# Altium project Logic_Gates_4.PrjPcb (part 2 of 2)

## Sheet Sound.SchDoc: =SheetTitle
size A4; CompanyName: Catcatcat Electronics; Engineer: Hena Chernov; Organization: Catcatcat Electronics; SheetNumber: 7; SheetTotal: 10; CodePhone: +380505759863; SheetDescription: Interactive tactile and audio feedback module.; Email: catcatcat.electronics@gmail.com
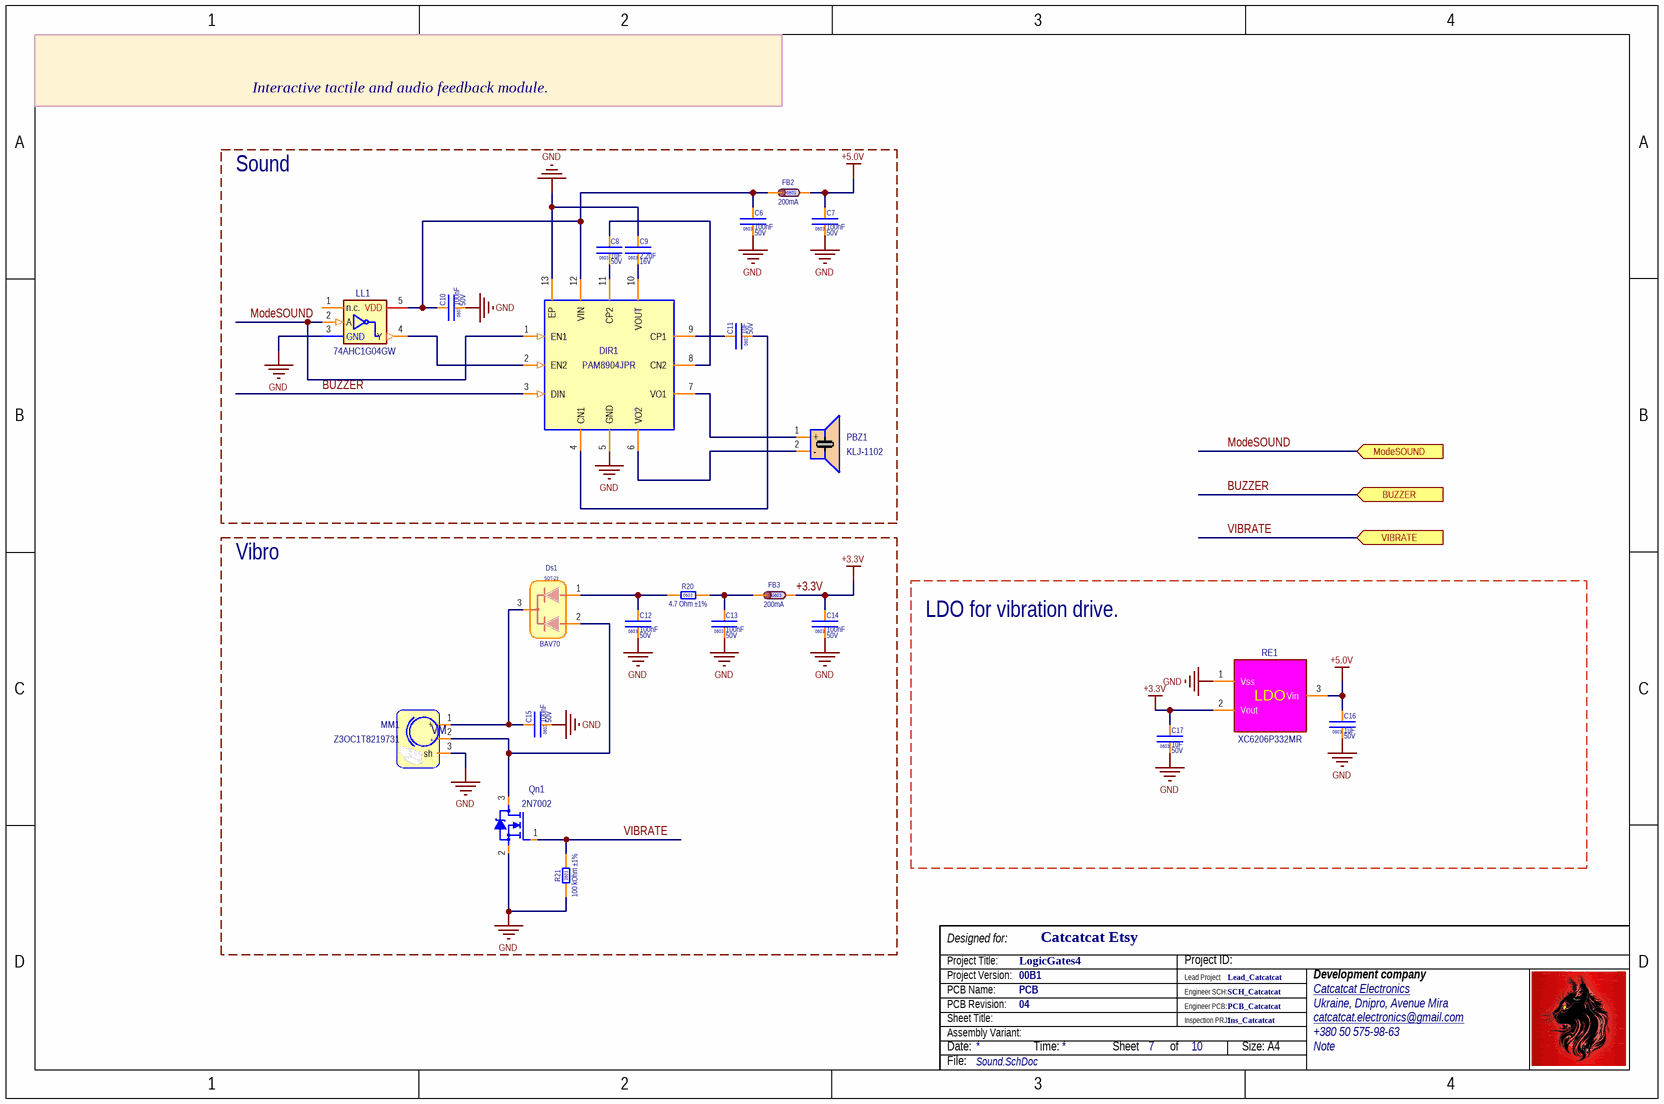
[diagram p7: Sound.SchDoc]

### Parts
C6  value 100nF  Voltage: 50V  [CC0603(1608)x0.8]  (hidden comment: 100 nF ±10% 50V)
C7  value 100nF  Voltage: 50V  [CC0603(1608)x0.8]  (hidden comment: 100 nF ±10% 50V)
C8  value 1uF  Voltage: 50V  [CC0603(1608)x0.8]  (hidden comment: 1uF ±10% 50V 0603)
C9  value 2.2uF  Voltage: 16V  [CC0603(1608)x0.8]  (hidden comment: 2.2uF ±10% 16V 0603)
C10  value 100nF  Voltage: 50V  [CC0603(1608)x0.8]  (hidden comment: 100 nF ±10% 50V)
C11  value 1uF  Voltage: 50V  [CC0603(1608)x0.8]  (hidden comment: 1uF ±10% 50V 0603)
C12  value 100nF  Voltage: 50V  [CC0603(1608)x0.8]  (hidden comment: 100 nF ±10% 50V)
C13  value 100nF  Voltage: 50V  [CC0603(1608)x0.8]  (hidden comment: 100 nF ±10% 50V)
C14  value 100nF  Voltage: 50V  [CC0603(1608)x0.8]  (hidden comment: 100 nF ±10% 50V)
C15  value 100nF  Voltage: 50V  [CC0603(1608)x0.8]  (hidden comment: 100 nF ±10% 50V)
C16  value 1uF  Voltage: 50V  [CC0603(1608)x0.8]  (hidden comment: 1uF ±10% 50V 0603)
C17  value 1uF  Voltage: 50V  [CC0603(1608)x0.8]  (hidden comment: 1uF ±10% 50V 0603)
DIR1  PAM8904JPR  [FP-U-QFN3030-12_Type_B-IPC_C]
Ds1  Case/Package: SOT-23  [SOT-23 - pdf]  (hidden comment: BAV70)
FB2  value 200mA  [FB0603(1608)]  (hidden comment: GZ1608D601TF)
FB3  value 200mA  [FB0603(1608)]  (hidden comment: GZ1608D601TF)
LL1  value 74AHC1G04GW  [SOT353-5-TSSOP-M]  (hidden comment: 74AHC1G04GW,125)
MM1  Z3OC1T8219731  [VibrationMotor]
PBZ1  KLJ-1102  [Cy-SMD-1102-5041]
Qn1  2N7002  [SOT-23 - pdf]
R20  value 4.7 Ohm ±1%  [RC0603(1608) -1%]  (hidden comment: 4.7R ±1% 0603)
R21  value 100 kOhm ±1%  [RC0603(1608) -1%]  (hidden comment: 100K ±1%)
RE1  XC6206P332MR  [FP-SOT23-IPC_C]

### Blocks framed on the sheet
Sound: C6-C11 DIR1 FB2 LL1 PBZ1
Vibro: C12-C15 Ds1 FB3 MM1 Qn1 R20 R21
LDO for vibration drive.: C16 C17 RE1

### Ports
BUZZER (in), ModeSOUND (in), VIBRATE (in)

### Nets
+3.3V: C14.2 C17.2 FB3.2 RE1.2(Vout)
+5.0V: C7.2 C16.2 FB2.2 RE1.3(Vin)
GND: C6.1 C7.1 C9.2 C10.1 C12.1 C13.1 C14.1 C15.1 C16.1 C17.1 DIR1.5(GND) DIR1.13(EP) LL1.3(GND) MM1.3(sh) Qn1.2(S) R21.1 RE1.1(Vss)
BUZZER: DIR1.3(DIN) ; port BUZZER
ModeSOUND: DIR1.1(EN1) LL1.2(A) ; port ModeSOUND
VIBRATE: Qn1.1(G) R21.2 ; port VIBRATE
NetC6_2: C6.2 C10.2 DIR1.12(VIN) FB2.1 LL1.5(VDD)
NetC8_1: C8.1 DIR1.11(CP2)
NetC8_2: C8.2 DIR1.8(CN2)
NetC9_1: C9.1 DIR1.10(VOUT)
NetC11_1: C11.1 DIR1.4(CN1)
NetC11_2: C11.2 DIR1.9(CP1)
NetC12_2: C12.2 Ds1.1 R20.1
NetC13_2: C13.2 FB3.1 R20.2
NetC15_2: C15.2 Ds1.3 MM1.1(+)
NetDIR1_2: DIR1.2(EN2) LL1.4(Y)
NetDIR1_6: DIR1.6(VO2) PBZ1.2(-)
NetDIR1_7: DIR1.7(VO1) PBZ1.1(+)
NetDs1_2: Ds1.2 MM1.2(-) Qn1.3(D)

Not connected (* = marked no-connect by the designer): LL1 1(n.c.)

### Notes on the sheet
- Project Title:
- Project Version:
- Designed for:
- Lead Project
- Project ID:
- Development company
- Date:
- PCB Revision:
- PCB Name:
- Sheet Title:
- Assembly Variant:
- Time:
- Sheet
- of
- Engineer SCH:
- Engineer PCB:
- Inspection PRJ:
- Size: A4
- File:
- (in symbol XC6206P332MR (B)) LDO
- (in symbol Z3OC1T8219731 (E)) VM

### Library data of the parts
C6 C7 C10 C12-C15 = 0603 0.1 uF (B): 100 nF ±10% 50V X7R; Manufacturer 1: YAGEO; Manufacturer Part Number 1: CC0603KRX7R9BB104; Note: Ceramic Capacitors; Detailed Description: 50V 100nF X7R ±10% 0603  Multilayer Ceramic Capacitors MLCC - SMD/SMT ROHS; Case/Package: 0603; Publisher: Catcatcat Electronics; Tolerance: ±10%; HelpURL: https://datasheet.lcsc.com/lcsc/1809301912_YAGEO-CC0603KRX7R9BB104_C14663.pdf; website developer: http://catcatcat.d-lan.dp.ua/; Temperature Coefficient: X7R; Supplier URL 1: https://jlcpcb.com/parts/componentSearch?searchTxt=; Operating Temperature: -55C to +125C; Supplier Part Number 1: C14663; Supplier Unit Price 1: 0.0021; Assembly type: Basic Part; Footprint check status: Verified; QuantityElements: 1; Supplier 1: LCSC; MountType: SMD
C8 C11 C16 C17 = 0603 1.0 uF 50V (B): 1.0 uF ±10% 50V X5R; Manufacturer 1: Samsung Electro-Mechanics; Manufacturer Part Number 1: CL10A105KB8NNNC; Note: Ceramic Capacitors; Detailed Description: 50V 1uF X5R ±10% 0603  Multilayer Ceramic Capacitors MLCC - SMD/SMT ROHS; Case/Package: 0603; Publisher: Catcatcat Electronics; Tolerance: ±10%; HelpURL: https://datasheet.lcsc.com/szlcsc/Samsung-Electro-Mechanics-CL10A105KB8NNNC_C15849.pdf; Website Developer: http://catcatcat.d-lan.dp.ua/; Temperature Coefficient: X5R; Supplier URL 1: https://jlcpcb.com/parts/componentSearch?searchTxt=; Operating Temperature: -55C to +125C; Supplier Part Number 1: C15849; Supplier Unit Price 1: 0.0051; Assembly type: Basic Part; Footprint check status: Verified; QuantityElements: 1; Supplier 1: LCSC; MountType: SMD
C9 = 0603 2.2 uF 16V (B): 2.2 uF ±10% 16V X5R; Manufacturer 1: Samsung Electro-Mechanics; Manufacturer Part Number 1: CL10A225KO8NNNC; Note: Ceramic Capacitors; Detailed Description: 16V 2.2uF X5R ±10% 0603  Multilayer Ceramic Capacitors MLCC - SMD/SMT ROHS; Case/Package: 0603; Publisher: Catcatcat Electronics; Tolerance: ±10%; HelpURL: https://datasheet.lcsc.com/szlcsc/Samsung-Electro-Mechanics-CL10A225KO8NNNC_C23630.pdf; website developer: http://catcatcat.d-lan.dp.ua/; Temperature Coefficient: X5R; Supplier URL 1: https://jlcpcb.com/parts/componentSearch?searchTxt=; Operating Temperature: -55C to +125C; Supplier Part Number 1: C23630; Supplier Unit Price 1: 0.0059; Assembly type: Basic Part; Footprint check status: Verified; QuantityElements: 1; Supplier 1: LCSC; MountType: SMD
DIR1 = PAM8904JPR (E): PIEZO SOUNDER DRIVER 18VPP OUTPUT; Manufacturer 1: Diodes Incorporated; Note: A/D converter; Temp.Characteristic: -40°C ~ 85°C (TA); Voltage: 1.8V to 5.5V; Output Impedance: Ohms; Output Power: W; Total Harmonic Distortion: %; Supplier URL 1: https://www.lcsc.com/product-detail/Audio-Power-OpAmps_Diodes-Incorporated-PAM8904JPR_C780875.html; HelpURL: https://datasheet.lcsc.com/lcsc/2210281000_Diodes-Incorporated-PAM8904JPR_C780875.pdf; Manufacturer Part Number 1: PAM8904JPR; Case/Package: UQFN3030-12; Supplier Unit Price 1: 0.4560; Publisher: Catcatcat Electronics; Website Developer: http://catcatcat.d-lan.dp.ua/; Detailed Description: PIEZO SOUNDER DRIVER 18VPP OUTPUT; Operating Temperature: -40 to +85°C; Supplier Part Number 1: C780875; Assembly type: Extended Part; Footprint check status: Verified; QuantityElements: 1; Supplier 1: LCSC; MountType: SMD; ECCN: EAR99; Value: PAM8904JPR
Ds1 = BAV70 (B): Switching SOT-23, 200 mA 70 V; Manufacturer 1: Changjiang Electronics Tech (CJ); Temp.Characteristic: -40C to +85C; Voltage: 70 V; Note: Diode; Marking: A4; Detailed Description: 70V +150℃@(Tj) 225mW Dual Common Cathode 1.25V@150mA 6ns 2.5uA@70V 200mA SOT-23  Switching Diode ROHS; Current: 150mA; Reverse Current (uA/5V/25°C): uA; Publisher: Catcatcat Electronics; HelpURL: https://datasheet.lcsc.com/lcsc/1809211023_Jiangsu-Changjing-Electronics-Technology-Co---Ltd--BAV70_C68978.pdf; Manufacturer Part Number 1: BAV70; Website developer: http://catcatcat.d-lan.dp.ua/; Supplier URL 1: https://www.lcsc.com/product-detail/Switching-Diode_Jiangsu-Changjing-Electronics-Technology-Co-Ltd-BAV70_C68978.html; Supplier Part Number 1: C68978; Supplier Unit Price 1: 0.0195; Assembly type: Basic Part; Footprint check status: Verified; QuantityElements: 1; Supplier 1: LCSC; MountType: SMD; Value: BAV70
FB2 FB3 = 0603 GZ1608D601TF (B): 0.20A 600 Ohm @100MHz 450 mOhm; Manufacturer 1: Sunlord; Temp.Characteristic: -55°C ~ 125°C; Note: Ferrite Beads and Chips; Detailed Description: 450mΩ ±25% 600Ω@100MHz 0603  Ferrite Beads ROHS; Case/Package: 0603; Publisher: Catcatcat Electronics; HelpURL: https://datasheet.lcsc.com/lcsc/1811091241_Sunlord-GZ1608D601TF_C1002.pdf; website developer: http://catcatcat.d-lan.dp.ua/; Manufacturer Part Number 1: GZ1608D601TF; Supplier URL 1: https://jlcpcb.com/parts/componentSearch?searchTxt=; Supplier Part Number 1: C1002; Supplier Unit Price 1: 0.0045; Assembly type: Basic Part; Footprint check status: Verified; QuantityElements: 1; Supplier 1: LCSC; MountType: SMD
LL1 = 74AHC1G04GW,125 (E): IC INVERTER 1CH 1-INP 5TSSOP; Manufacturer 1: Nexperia USA Inc.; Voltage: 2 V ~ 5.5 V; Note: Inverter IC 1 Channel; Detailed Description: Inverter IC 1 Channel  5-TSSOP; Supplier URL 1: https://www.digikey.com/product-detail/en/nexperia-usa-inc/74AHC1G04GW125/1727-3147-2-ND/1022776; Publisher: Catcatcat Electronics; Operating Temperature: -40°C ~ 125°C (TA); HelpURL: https://assets.nexperia.com/documents/data-sheet/74AHC_AHCT1G04.pdf; Manufacturer Part Number 1: 74AHC1G04GW,125; Website developer: http://catcatcat.d-lan.dp.ua/; Case/Package: 5-TSSOP, SC-70-5, SOT-353; Supplier Part Number 1: C148197; Supplier Unit Price 1: 0.0493; Assembly type: Extended Part; Footprint check status: Verified; QuantityElements: 1; Supplier 1: LCSC; MountType: SMD
MM1 = Z3OC1T8219731 (E): DC Motor Vibration, ROHS; Manufacturer 1: KOTL; Note: Micro Motor & Motor ROHS; Voltage: 2-3.6V; Assembly type: Extended Part; HelpURL: https://www.endrich.com/sixcms/media.php/2/Z30C1T8219651.pdf; Manufacturer Part Number 1: Z3OC1T8219731; Case/Package: SMD; Supplier Part Number 1: C2894731; Supplier Unit Price 1: 0.6504; Publisher: Catcatcat Electronics; Website developer: http://catcatcat.d-lan.dp.ua/; Footprint check status: Verified; QuantityElements: 1; Supplier 1: LCSC; MountType: Plug-in; Value: Z3OC1T8219731
PBZ1 = KLJ-1102 (E): Piezoelectric buzzer, Externally Driven 70dB@5V,10cm Externally Driven SMD,9x11mm  Buzzers ROHS; Manufacturer 1: KELIKING; Voltage: 5V; Current: ≤120mA; Sound Pressure Level (dB/min.): ≥75dB; Assembly type: Extended Part; Supplier URL 1: https://www.lcsc.com/product-detail/Buzzers_KELIKING-KLJ-1102_C201047.html; Detailed Description: Externally Driven 70dB@5V,10cm Externally Driven SMD,9x11mm  Buzzers ROHS; HelpURL: https://datasheet.lcsc.com/lcsc/1808301123_KELIKING-KLJ-1102_C201047.pdf; Manufacturer Part Number 1: KLJ-1102; Note: Piezoelectric buzzer; Operating Temperature: -20 ~ +80; Case/Package: SMD,9x11mm; Supplier Part Number 1: C201047; Supplier Unit Price 1: 0.4680; Publisher: Catcatcat Electronics; Website developer: http://catcatcat.d-lan.dp.ua/; Footprint check status: Verified; QuantityElements: 1; Supplier 1: LCSC; MountType: SMD; Value: KLJ-1102
Qn1 = 2N7002 (B): N-Channel SOT-23 60V 115mA 200mW 7.5Ω@10V,500mA 2.5V@250uA  SOT-23(SOT-23-3)  MOSFETs ROHS; Manufacturer 1: Changjiang Electronics Tech (CJ); Note: Transistor; Temp.Characteristic: -40C to +85C; Marking: 7002; Detailed Description: 60V 115mA 200mW 7.5Ω@10V,500mA 2.5V@250uA N Channel SOT-23(SOT-23-3)  MOSFETs ROHS; Supplier Unit Price 1: 0.0139; Publisher: Catcatcat Electronics; Voltage: 60V; Supplier URL 1: https://jlcpcb.com/parts/componentSearch?searchTxt=C8545; HelpURL: https://datasheet.lcsc.com/szlcsc/Changjiang-Electronics-Tech-CJ-2N7002_C8545.pdf; Manufacturer Part Number 1: 2N7002; Website developer: http://catcatcat.d-lan.dp.ua/; Operating Temperature: -55°C ~ 150°C (TJ); Case/Package: SOT-23; Supplier Part Number 1: C8545; Assembly type: Basic Part; Footprint check status: Verified; QuantityElements: 1; Supplier 1: LCSC; MountType: SMD; Value: 2N7002
R20 = 0603 4.7 Ohm ±1% (B): 4.7 R (4R7) ±1% 1/10W 75V; Manufacturer 1: UNI-ROYAL(Uniroyal Elec); Manufacturer Part Number 1: 0603WAF470KT5E; Note: Chip Resistor - Surface Mount; Temperature Coefficient: ±400ppm/℃; Detailed Description: 100mW Thick Film Resistors ±1% ±400ppm/℃ 4.7Ω 0603  Chip Resistor - Surface Mount ROHS; Publisher: Catcatcat Electronics; Tolerance: ±1%; Voltage: 75V; HelpURL: https://datasheet.lcsc.com/lcsc/2206010116_UNI-ROYAL-Uniroyal-Elec-0603WAF470KT5E_C23164.pdf; Marking: 4R7; Power (Watts): 1/10W; Supplier URL 1: https://www.lcsc.com/product-detail/Chip-Resistor-Surface-Mount_UNI-ROYAL-Uniroyal-Elec-0603WAF470KT5E_C23164.html; Manufacturer URL: http://uniohm.com/; Operating Temperature: -55°C ~ 155°C; Supplier Part Number 1: C23164; Supplier Unit Price 1: 0.0014; Assembly type: Basic Part; Footprint check status: Verified; QuantityElements: 1; Supplier 1: LCSC; Website Developer: http://catcatcat.d-lan.dp.ua/; MountType: SMD; Case/Package: 0603
R21 = 0603 100 kOhm ±1% (B): 100 k (104) ±1% 1/10W 50V; Manufacturer 1: UNI-ROYAL(Uniroyal Elec); Manufacturer Part Number 1: 0603WAF1003T5E; Note: Chip Resistor - Surface Mount; Temperature Coefficient: ±100 ppm/℃; Detailed Description: 100mW Thick Film Resistors ±100ppm/℃ ±1% 100kΩ 0603  Chip Resistor - Surface Mount ROHS; Publisher: Catcatcat Electronics; Tolerance: ±1%; Voltage: 50V; HelpURL: https://datasheet.lcsc.com/szlcsc/Uniroyal-Elec-0603WAF1003T5E_C25803.pdf; Power (Watts): 1/10W; Supplier URL 1: https://jlcpcb.com/parts/componentSearch?searchTxt=C25803; Operating Temperature: -55°C ~ 155°C; Supplier Part Number 1: C25803; Supplier Unit Price 1: 0.0009; Assembly type: Basic Part; Footprint check status: Verified; QuantityElements: 1; Supplier 1: LCSC; Website Developer: http://catcatcat.d-lan.dp.ua/; MountType: SMD; Case/Package: 0603
RE1 = XC6206P332MR (B): LDO 5.0V 3.3V 200mA Fixed 3.3V~3.3V Positive 6V SOT-23-3L  Linear Voltage Regulators (LDO) ROHS; Manufacturer 1: Torex Semicon; Note: LOW DROPOUT REGULATORS(LDO); Marking: 662V; Voltage - Input (Min)/(Max): 5V; Supplier URL 1: https://jlcpcb.com/parts/componentSearch?searchTxt=C5446; Case/Package: SOT-23-3L; Supplier Part Number 1: C5446; Operating Temperature: -40C to +85C; Voltage: 3.3V; HelpURL: https://eu.mouser.com/datasheet/2/760/TOSL_S_A0007229533_1-2575067.pdf; Manufacturer Part Number 1: XC6206P332MR; Detailed Description: 200mA Fixed 3.3V~3.3V Positive 6V SOT-23-3L  Linear Voltage Regulators (LDO) ROHS; Supplier Unit Price 1: 0.0992; Publisher: Catcatcat Electronics; Website developer: http://catcatcat.d-lan.dp.ua/; Assembly type: Basic Part; Footprint check status: Verified; Current - Output (Max): 200mA; QuantityElements: 1; Supplier 1: LCSC; MountType: SMD; Value: XC6206P332MR

## Sheet USB Power.SchDoc: =SheetTitle
size A4; CompanyName: Catcatcat Electronics; Engineer: Hena Chernov; Organization: Catcatcat Electronics; SheetNumber: 10; SheetTotal: 10; CodePhone: +380505759863; SheetDescription: Power, USB-bridge.; Email: catcatcat.electronics@gmail.com
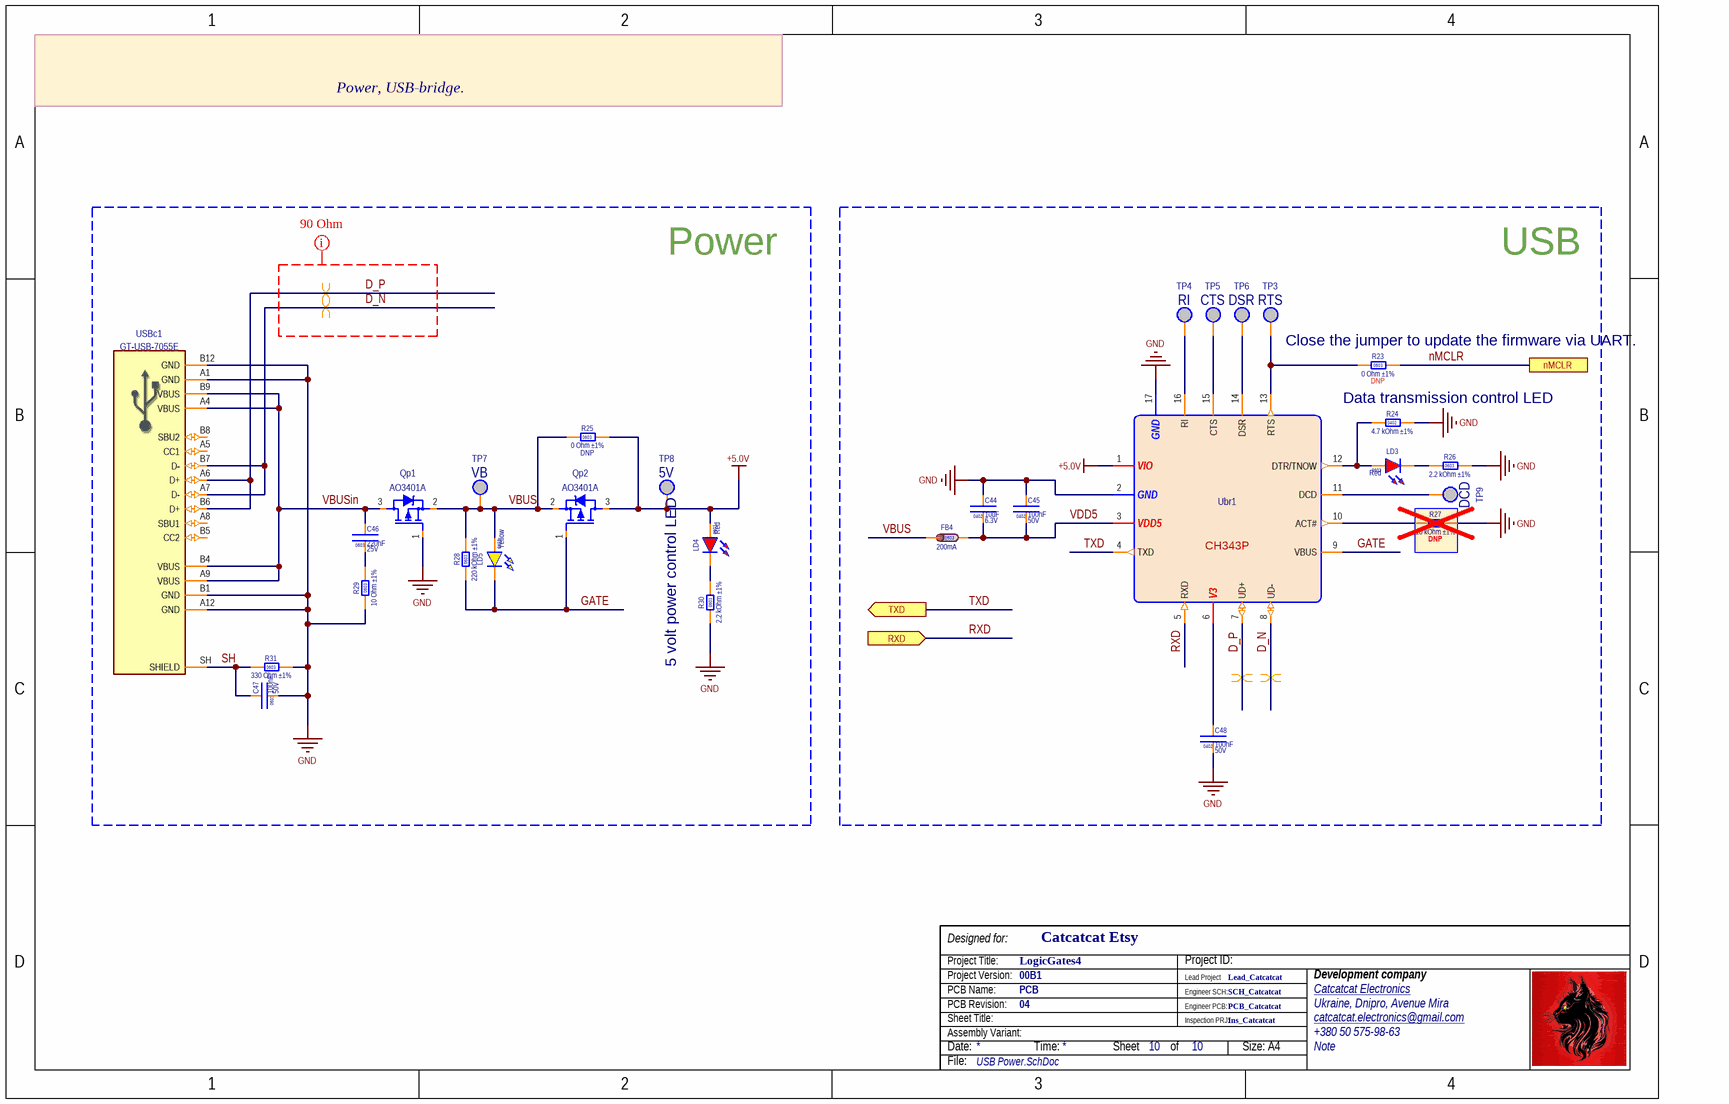
[diagram p8: USB Power.SchDoc]

### Parts
C44  value 10uF  Voltage: 6.3V  [CC0402(1005)x0.5]  (hidden comment: 10 uF 6.3V ±10%)
C45  value 100nF  Voltage: 50V  [CC0402(1005)x0.5]  (hidden comment: 100nF 50V ±10% 0402)
C46  value 220nF  Voltage: 25V  [CC0603(1608)x0.8]  (hidden comment: 0.22 uF ±10%)
C47  value 100nF  Voltage: 50V  [CC0603(1608)x0.8]  (hidden comment: 100 nF ±10% 50V)
C48  value 100nF  Voltage: 50V  [CC0402(1005)x0.5]  (hidden comment: 100nF 50V ±10% 0402)
FB4  value 200mA  [FB0603(1608)]  (hidden comment: GZ1608D601TF)
LD3  value Red  Case/Package: 0603  [LD0603 RED]  (hidden comment: KT-0603R)
LD4  value Red  Case/Package: 0603  [LD0603 RED]  (hidden comment: KT-0603R)
LD5  value Yellow  Case/Package: 0603  [LD0603 YELLOW]  (hidden comment: LED 0603 Yellow 120° 60mW)
Qp1  AO3401A  [FP-SOT23-IPC_C]
Qp2  AO3401A  [FP-SOT23-IPC_C]
R23  value 0 Ohm ±1%  Assembly type: DNP  [RC0603(1608)A J]  (hidden comment: 0R ±1% 0603)
R24  value 4.7 kOhm ±1%  [RC0402(1005)-1%]  (hidden comment: 4.7K ±1% 0402)
R25  value 0 Ohm ±1%  Assembly type: DNP  [RC0603(1608)A J]  (hidden comment: 0R ±1% 0603)
R26  value 2.2 kOhm ±1%  [RC0603(1608) -1%]  (hidden comment: 2.2K ±1% 0603)
R27  value 10 kOhm ±1%  Assembly type: DNP  [RC0402(1005)-1%]  (hidden comment: 10K ±1% 0402 50V)
R28  value 220 kOhm ±1%  [RC0603(1608) -1%]  (hidden comment: 220 K ±1%)
R29  value 10 Ohm ±1%  [RC0603(1608) -1%]  (hidden comment: 10R ±1% 0603)
R30  value 2.2 kOhm ±1%  [RC0603(1608) -1%]  (hidden comment: 2.2K ±1% 0603)
R31  value 330 Ohm ±1%  [RC0603(1608) -1%]  (hidden comment: 330 R ±1%)
TP3  RTS  [Test_Point_T_0.6mm]  (no BOM)
TP4  RI  [Test_Point_T_0.6mm]  (no BOM)
TP5  CTS  [Test_Point_T_0.6mm]  (no BOM)
TP6  DSR  [Test_Point_T_0.6mm]  (no BOM)
TP7  VB  [Test_Point_T_0.6mm]  (no BOM)
TP8  5V  [Test_Point_T_0.6mm]  (no BOM)
TP9  DCD  [Test_Point_T_0.6mm]  (no BOM)
Ubr1  CH343P  [TQFN-16-JLC]
USBc1  GT-USB-7055E  [TYPE-C16PIN-C7450622]

### Blocks framed on the sheet
Power: C46 C47 LD4 LD5 Qp1 Qp2 R25 R28-R31 TP7 TP8 USBc1
USB: C44 C45 C48 FB4 LD3 R23 R24 R26 R27 TP3-TP6 TP9 Ubr1

### Ports
nMCLR, RXD (in), TXD (out)

### Nets
+5.0V: LD4.2 Qp2.3(D) R25.2 TP8.1 Ubr1.1(VIO)
GND: C44.2 C45.2 C47.1 C48.1 Qp1.1(G) R24.2 R26.1 R27.2 R29.1 R30.1 R31.2 Ubr1.2(GND) Ubr1.17(GND) USBc1.A1(GND) USBc1.A12(GND) USBc1.B1(GND) USBc1.B12(GND)
D_N: Ubr1.8(UD-) USBc1.A7(D-) USBc1.B7(D-)
D_P: Ubr1.7(UD+) USBc1.A6(D+) USBc1.B6(D+)
GATE: LD5.1 Qp2.1(G) R28.1 Ubr1.9(VBUS)
nMCLR: R23.2 ; port nMCLR
RXD: Ubr1.5(RXD) ; port RXD
SH: C47.2 R31.1 USBc1.SH(SHIELD)
TXD: Ubr1.4(TXD) ; port TXD
VBUS: FB4.1 LD5.2 Qp1.2(S) Qp2.2(S) R25.1 R28.2 TP7.1
VBUSin: C46.2 Qp1.3(D) USBc1.A4(VBUS) USBc1.A9(VBUS) USBc1.B4(VBUS) USBc1.B9(VBUS)
VDD5: C44.1 C45.1 FB4.2 Ubr1.3(VDD5)
NetC46_1: C46.1 R29.2
NetC48_2: C48.2 Ubr1.6(V3)
NetLD3_1: LD3.1 R26.2
NetLD3_2: LD3.2 R24.1 Ubr1.12(DTR/TNOW)
NetLD4_1: LD4.1 R30.2
NetR23_1: R23.1 TP3.1 Ubr1.13(RTS)
NetR27_1: R27.1 Ubr1.10(ACT#)
NetTP4_1: TP4.1 Ubr1.16(RI)
NetTP5_1: TP5.1 Ubr1.15(CTS)
NetTP6_1: TP6.1 Ubr1.14(DSR)
NetTP9_1: TP9.1 Ubr1.11(DCD)

Not connected (* = marked no-connect by the designer): USBc1 A5(CC1) A8(SBU1) B5(CC2) B8(SBU2)

### Layout directives
differential pair: D_N, D_P
net class USB90Ohm: D_N, D_P

### Notes on the sheet
- Close the jumper to update the firmware via UART.
- Data transmission control LED
- (near TP8) 5 volt power control LED
- Project Title:
- Project Version:
- Designed for:
- Lead Project
- Project ID:
- Development company
- Date:
- PCB Revision:
- PCB Name:
- Sheet Title:
- Assembly Variant:
- Time:
- Sheet
- of
- Engineer SCH:
- Engineer PCB:
- Inspection PRJ:
- Size: A4
- File:

### Library data of the parts
C44 = 0402 10 uF 6.3V (B): 10 uF ±10% 6.3V X7R; Manufacturer 1: Samsung Electro-Mechanics; Manufacturer Part Number 1: CL05A106MQ5NUNC; Note: Ceramic Capacitors; Detailed Description: MULTILAYER CERAMIC CAPACITORS MLCC - SMD/SMT 10UF 6.3V 0402 ROHS; Case/Package: 0402; Publisher: Catcatcat Electronics; Tolerance: ±10 %; website developer: http://catcatcat.d-lan.dp.ua/; Supplier URL 1: https://jlcpcb.com/parts/componentSearch?searchTxt=; Operating Temperature: -55C to +125C; Supplier Part Number 1: C15525; Supplier Unit Price 1: 0.0052; Assembly type: Basic Part; Footprint check status: Verified; QuantityElements: 1; Supplier 1: LCSC; MountType: SMD
C45 C48 = 0402 0.1 uF 50V (B): 100 nF ±10% 50V X7R; Manufacturer 1: Guangdong Fenghua Advanced Tech; Manufacturer Part Number 1: CL05B104KB54PNC; Note: Ceramic Capacitors; Detailed Description: 50V 100nF X7R ±10% 0402 Multilayer Ceramic Capacitors MLCC - SMD/SMT ROHS; Case/Package: 0402; Publisher: Catcatcat Electronics; Tolerance: ±10 %; HelpURL: https://datasheet.lcsc.com/lcsc/1810191222_Samsung-Electro-Mechanics-CL05B104KB54PNC_C307331.pdf; website developer: http://catcatcat.d-lan.dp.ua/; Temperature Coefficient: X7R; Supplier URL 1: https://jlcpcb.com/parts/componentSearch?searchTxt=; Operating Temperature: -55C to +125C; Supplier Part Number 1: C307331; Supplier Unit Price 1: 0.0065; Assembly type: Basic Part; Footprint check status: Verified; QuantityElements: 1; Supplier 1: LCSC; MountType: SMD
C46 = 0603 0.22 uF 25V (B): 220 nF ±10% 25V X7R; Manufacturer 1: Samsung Electro-Mechanics; Manufacturer Part Number 1: CL10B224KA8NNNC; Note: Ceramic Capacitors; Detailed Description: 25V 220nF X7R ±10% 0603 Multilayer Ceramic Capacitors MLCC - SMD/SMT ROHS; Case/Package: 0603; Publisher: Catcatcat Electronics; Tolerance: ±10%; HelpURL: https://datasheet.lcsc.com/lcsc/1810261513_Samsung-Electro-Mechanics-CL10B224KA8NNNC_C21120.pdf; website developer: http://catcatcat.d-lan.dp.ua/; Temperature Coefficient: X7R; Supplier URL 1: https://jlcpcb.com/parts/componentSearch?searchTxt=; Operating Temperature: -55C to +125C; Supplier Part Number 1: C21120; Supplier Unit Price 1: 0.0045; Assembly type: Basic Part; Footprint check status: Verified; QuantityElements: 1; Supplier 1: LCSC; MountType: SMD
C47 = 0603 0.1 uF (B): as C6 on sheet Sound; Case/Package: 0603; Publisher: Catcatcat Electronics; Tolerance: ±10%; HelpURL: https://datasheet.lcsc.com/lcsc/1809301912_YAGEO-CC0603KRX7R9BB104_C14663.pdf; website developer: http://catcatcat.d-lan.dp.ua/; Temperature Coefficient: X7R; Supplier URL 1: https://jlcpcb.com/parts/componentSearch?searchTxt=; Operating Temperature: -55C to +125C; Supplier Part Number 1: C14663; Supplier Unit Price 1: 0.0021; Assembly type: Basic Part; Footprint check status: Verified; QuantityElements: 1; Supplier 1: LCSC; MountType: SMD
FB4 = 0603 GZ1608D601TF (B): as FB2 on sheet Sound; Case/Package: 0603; Publisher: Catcatcat Electronics; HelpURL: https://datasheet.lcsc.com/lcsc/1811091241_Sunlord-GZ1608D601TF_C1002.pdf; website developer: http://catcatcat.d-lan.dp.ua/; Manufacturer Part Number 1: GZ1608D601TF; Supplier URL 1: https://jlcpcb.com/parts/componentSearch?searchTxt=; Supplier Part Number 1: C1002; Supplier Unit Price 1: 0.0045; Assembly type: Basic Part; Footprint check status: Verified; QuantityElements: 1; Supplier 1: LCSC; MountType: SMD
LD3 LD4 = KT-0603R (B): 0603 Red 520~625NM 90~100MCD@20MA Top View RoHS; Manufacturer 1: Hubei KENTO Elec; Note: LED Red; Temp.Characteristic: -40C to +85C; Detailed Description: -40℃~+85℃ Red 0603  Light Emitting Diodes (LED) ROHS; Millicandela Rating: 30~50mcd@5mA; Wavelength(Range or typical): 619~625nm; Publisher: Catcatcat Electronics; Manufacturer Part Number 1: KT-0603R; Supplier URL 1: https://www.lcsc.com/product-detail/Light-Emitting-Diodes-LED_Hubei-KENTO-Elec-KT-0603R_C2286.html; Operating Temperature: -40°C~+85°C; Supplier Part Number 1: C2286; Supplier Unit Price 1: 0.0053; HelpURL: https://datasheet.lcsc.com/szlcsc/Hubei-KENTO-Elec-KT-0603R_C2286.pdf; Website developer: http://catcatcat.d-lan.dp.ua/; Assembly type: Basic Part; Footprint check status: Verified; QuantityElements: 1; Supplier 1: LCSC; MountType: SMD
LD5 = 19-213/Y2C-CQ2R2L/3T(CY) (B): 0603 Yellow Colorless transparence -40℃~+85℃ 585.5nm~591.5nm yellow 120° 60mW 0603  Light Emitting Diodes (LED) ROHS; Manufacturer 1: Everlight Elec; Temp.Characteristic: -40C to +85C; Millicandela Rating: 90~180mcd@20mA; Wavelength(Range or typical): 585.5~591.5nm; Publisher: Catcatcat Electronics; Note: Light Emitting Diodes; Manufacturer Part Number 1: 19-213/Y2C-CQ2R2L/3T(CY); Detailed Description: Colorless transparence -40℃~+85℃ 585.5nm~591.5nm yellow 120° 60mW 0603  Light Emitting Diodes (LED) ROHS; Supplier URL 1: https://www.lcsc.com/product-detail/Light-Emitting-Diodes-LED_Everlight-Elec-19-213-Y2C-CQ2R2L-3T-CY_C72038.html; Supplier Part Number 1: C72038; Supplier Unit Price 1: 0.0195; HelpURL: https://datasheet.lcsc.com/lcsc/1810101813_Everlight-Elec-19-213-Y2C-CQ2R2L-3T-CY_C72038.pdf; Website developer: http://catcatcat.d-lan.dp.ua/; Assembly type: Basic Part; Footprint check status: Verified; QuantityElements: 1; Supplier 1: LCSC; MountType: SMD
Qp1 Qp2 = AO3401A (B): P-Channel SOT-23-3L 30V 4A 44mΩ@10V,4.3A 1.4W 1.3V@250uAl SOT-23-3L  MOSFETs ROHS; Manufacturer 1: Alpha & Omega Semicon; Note: Transistor; Temp.Characteristic: -40C to +85C; Voltage: 30V 4A; Detailed Description: 30V 4A 44mΩ@10V,4.3A 1.4W P Channel SOT-23  MOSFETs ROHS; Supplier Unit Price 1: 0.0591; Publisher: Catcatcat Electronics; Supplier URL 1: https://www.lcsc.com/product-detail/MOSFETs_Alpha-Omega-Semicon-AO3401A_C15127.html; HelpURL: https://datasheet.lcsc.com/szlcsc/Alpha-Omega-Semicon-AOS-AO3401A_C15127.pdf; Manufacturer Part Number 1: AO3401A; Website Developer: http://catcatcat.d-lan.dp.ua/; Operating Temperature: -55℃~+150℃@(Tj); Case/Package: SOT-23-3L; Supplier Part Number 1: C15127; Assembly type: Basic Part; Footprint check status: Verified; Current: 4A; QuantityElements: 1; Supplier 1: LCSC; MountType: SMD; Value: AO3401A
R23 R25 = 0603 0 Ohm ±1% (B): 0 R (000) ±5% 1/10W 50V; Manufacturer 1: Uniroyal Elec; Manufacturer Part Number 1: 0603WAF0000T5E; Note: Chip Resistor - Surface Mount; Temperature Coefficient: ±100ppm/°C; Detailed Description: CHIP RESISTOR - SURFACE MOUNT 0OHMS ±1% 1/10W 0603 ROHS; Publisher: Catcatcat Electronics; Tolerance: ±1%; Voltage: 50V; HelpURL: https://datasheet.lcsc.com/szlcsc/Uniroyal-Elec-0603WAF0000T5E_C21189.pdf; Website Developer: http://catcatcat.d-lan.dp.ua/; Power (Watts): 1/10W; Supplier URL 1: https://jlcpcb.com/parts/componentSearch?searchTxt=; Operating Temperature: -55°C ~ 155°C; Supplier Part Number 1: C21189; Supplier Unit Price 1: 0.0016; Footprint check status: Verified; QuantityElements: 1; Supplier 1: LCSC; MountType: SMD; Case/Package: 0603
R24 = 0402 4.7 kOhm ±1% (B): 4.7 k (4701)±1% 1/16W 50V; Manufacturer 1: UNI-ROYAL(Uniroyal Elec); Manufacturer Part Number 1: 0402WGF4701TCE; Note: Chip Resistor - Surface Mount; Temperature Coefficient: ±100ppm/℃; Detailed Description: ±1% 1/16W Thick Film Resistors 50V ±100ppm/℃ -55℃~+155℃ 4.7kΩ 0402 Chip Resistor - Surface Mount ROHS; Publisher: Catcatcat Electronics; Tolerance: ±1%; Voltage: 50V; HelpURL: Uniroyal-Elec-0402WGF4701TCE_C25900.pdf; Website Developer: http://catcatcat.d-lan.dp.ua/; Power (Watts): 1/16W; Supplier URL 1: https://jlcpcb.com/parts/componentSearch?searchTxt=C25900; Operating Temperature: -55°C ~ 155°C; Supplier Part Number 1: C25900; Supplier Unit Price 1: 0.0005; Assembly type: Basic Part; Footprint check status: Verified; QuantityElements: 1; Supplier 1: LCSC; MountType: SMD; Case/Package: 0402
R26 R30 = 0603 2.2 kOhm ±1% (B): 2.2 k (222) ±1% 1/10W 50V; Manufacturer 1: Uniroyal Elec; Manufacturer Part Number 1: 0603WAF2201T5E; Note: Chip Resistor - Surface Mount; Marking: 222; Temperature Coefficient: ±100ppm/℃; Detailed Description: 100mW Thick Film Resistors ±100ppm/℃ ±1% 2.2kΩ 0603  Chip Resistor - Surface Mount ROHS; Publisher: Catcatcat Electronics; Tolerance: ±1%; Voltage: 50V; HelpURL: https://datasheet.lcsc.com/szlcsc/Uniroyal-Elec-0603WAF2201T5E_C4190.pdf; Website Developer: http://catcatcat.d-lan.dp.ua/; Power (Watts): 1/10W; Supplier URL 1: https://jlcpcb.com/parts/componentSearch?searchTxt=; Operating Temperature: -55°C ~ 155°C; Supplier Part Number 1: C4190; Supplier Unit Price 1: 0.0009; Assembly type: Basic Part; Footprint check status: Verified; QuantityElements: 1; Supplier 1: LCSC; MountType: SMD; Case/Package: 0603
R27 = 0402 10 kOhm ±1% (B): 10 k ±1% 1/16W 50V; Manufacturer 1: Uniroyal Elec; Manufacturer Part Number 1: 0402WGF1002TCE; Note: Chip Resistor - Surface Mount; Temperature Coefficient: ±100ppm/°C; Detailed Description: 62.5mW Thick Film Resistors ±100ppm/℃ ±1% 10kΩ 0402  Chip Resistor - Surface Mount ROHS; Publisher: Catcatcat Electronics; Tolerance: ±1%; Voltage: 50V; HelpURL: https://datasheet.lcsc.com/szlcsc/Uniroyal-Elec-0402WGF1002TCE_C25744.pdf; Website Developer: http://catcatcat.d-lan.dp.ua/; Power (Watts): 1/16W; Supplier URL 1: https://jlcpcb.com/parts/componentSearch?searchTxt=C25744; Operating Temperature: -55°C ~ 155°C; Supplier Part Number 1: C25744; Supplier Unit Price 1: 0.0004; Footprint check status: Verified; QuantityElements: 1; Supplier 1: LCSC; MountType: SMD; Case/Package: 0402
R28 = 0603 220 kOhm ±1% (B): 220 k (224) ±5% 1/10W 50V; Manufacturer 1: Uniroyal Elec; Manufacturer Part Number 1: 0603WAF2203T5E; Note: Chip Resistor - Surface Mount; Marking: 224; Temperature Coefficient: ±100ppm/°C; Detailed Description: CHIP RESISTOR - SURFACE MOUNT 220KOHMS ±1% 1/10W 0603 ROHS; Publisher: Catcatcat Electronics; Tolerance: ±1%; Voltage: 50V; HelpURL: https://datasheet.lcsc.com/szlcsc/Uniroyal-Elec-0603WAF1603T5E_C22813.pdf; Website Developer: http://catcatcat.d-lan.dp.ua/; Power (Watts): 1/10W; Supplier URL 1: https://jlcpcb.com/parts/componentSearch?searchTxt=; Operating Temperature: -55°C ~ 155°C; Supplier Part Number 1: C22961; Supplier Unit Price 1: 0.0016; Assembly type: Basic Part; Footprint check status: Verified; QuantityElements: 1; Supplier 1: LCSC; MountType: SMD; Case/Package: 0603
R29 = 0603 10 Ohm ±1% (B): 10 R (XIO) ±1% 1/10W 50V ±400ppm/°C; Manufacturer 1: Uniroyal Elec; Manufacturer Part Number 1: 0603WAF100JT5E; Note: Chip Resistor - Surface Mount; Detailed Description: 100mW Thick Film Resistors ±1% ±400ppm/℃ 10Ω 0603  Chip Resistor - Surface Mount ROHS; Publisher: Catcatcat Electronics; Tolerance: ±1%; Voltage: 50V; HelpURL: https://datasheet.lcsc.com/szlcsc/Uniroyal-Elec-0603WAF100JT5E_C22859.pdf; Website Developer: http://catcatcat.d-lan.dp.ua/; Temperature Coefficient: ±400ppm/°C; Power (Watts): 1/10W; Supplier URL 1: https://jlcpcb.com/parts/componentSearch?searchTxt=C22859; Operating Temperature: -55°C ~ 155°C; Supplier Part Number 1: C22859; Supplier Unit Price 1: 0.0009; Assembly type: Basic Part; Footprint check status: Verified; QuantityElements: 1; Supplier 1: LCSC; MountType: SMD; Case/Package: 0603
R31 = 0603 330 Ohm ±1% (B): 330 R (331) ±5% 1/10W 50V; Manufacturer 1: Uniroyal Elec; Manufacturer Part Number 1: 0603WAF3300T5E; Note: Chip Resistor - Surface Mount; Temperature Coefficient: ±100ppm/°C; Detailed Description: CHIP RESISTOR - SURFACE MOUNT 330OHMS ±1% 1/10W 0603 ROHS; Publisher: Catcatcat Electronics; Tolerance: ±1%; Voltage: 50V; HelpURL: https://datasheet.lcsc.com/szlcsc/Uniroyal-Elec-0603WAF3300T5E_C23138.pdf; Website Developer: http://catcatcat.d-lan.dp.ua/; Power (Watts): 1/10W; Supplier URL 1: https://jlcpcb.com/parts/componentSearch?searchTxt=; Manufacturer URL: http://uniohm.com/; Operating Temperature: -55°C ~ 155°C; Supplier Part Number 1: C23138; Supplier Unit Price 1: 0.0019; Assembly type: Basic Part; Footprint check status: Verified; QuantityElements: 1; Supplier 1: LCSC; MountType: SMD; Case/Package: 0603
TP3-TP9 = Test_Point smd_0.6: Test Point TOP; Value: SMD; Assembly type: Test Point; Note: Test Point; Publisher: Catcatcat Electronics; Website developer: http://catcatcat.d-lan.dp.ua/; Footprint check status: Verified; Supplier URL 1: https://jlcpcb.com/parts/componentSearch?searchTxt=; Supplier 1: LCSC
Ubr1 = CH343P (E): USB Bridge, USB 2.0 Transceiver 2Mbps TQFN-16-EP(3x3); Manufacturer 1: WCH(Jiangsu Qin Heng); Detailed Description: USB 2.0 Transceiver 2Mbps SOP-16_150mil USB ICs ROHS; Supplier URL 1: https://jlcpcb.com/parts/componentSearch?searchTxt=C2846043; Publisher: Catcatcat Electronics; Note: USB; HelpURL: https://datasheet.lcsc.com/lcsc/2108172330_WCH-Jiangsu-Qin-Heng-CH343P_C2846043.pdf; Manufacturer Part Number 1: CH343P; Website Developer: http://catcatcat.d-lan.dp.ua/; Case/Package: TQFN-16-EP(3x3); Supplier Part Number 1: C2846043; Supplier Unit Price 1: 1.1284; Assembly type: Extended Part; Footprint check status: Verified; QuantityElements: 1; Supplier 1: LCSC; MountType: SMD; Value: CH343P
USBc1 = GT-USB-7055E (E): Type C V USB 2.0 5A 1 Brick nogging 16P Female -40℃~+85℃ Gold High Conductivity Copper Type-C SMD  USB Connectors ROHS; Manufacturer 1: G-Switch; Note: DIP+SMD USB Connectors RoHS; Temp.Characteristic: -20C to +70C; HelpURL: https://wmsc.lcsc.com/wmsc/upload/file/pdf/v2/lcsc/2307121106_G-Switch-GT-USB-7055E_C7450622.pdf; Publisher: Catcatcat Electronics; Manufacturer Part Number 1: GT-USB-7055E; Website developer: http://catcatcat.d-lan.dp.ua/; Detailed Description: USB 2.0 5A 1 Brick nogging 16P Female -40℃~+85℃ Gold High Conductivity Copper Type-C SMD  USB Connectors ROHS; Assembly type: Extended Part; Supplier URL 1: https://www.lcsc.com/product-detail/USB-Connectors_G-Switch-GT-USB-7055E_C7450622.html; Case/Package: SMD; Supplier Part Number 1: C7450622; Supplier Unit Price 1: 0.2603; Footprint check status: Verified; QuantityElements: 1; Supplier 1: LCSC; MountType: SMT/TH; Value: GT-USB-7055E

## Nets that join several sheets
+5.0V: Display (45 pins), MCU (C4.2 C5.1 FB1.1), Sound (C7.2 C16.2 FB2.2 RE1.3), USB Power (5 pins)
GND: Display (46 pins), MCU (11 pins), Sound (17 pins), USB Power (17 pins)
AND: MCU (R16.2), Touch Sensors (TSE3.1)
BUZZER: MCU (C2.2 R3.2), Sound (DIR1.3)
L0: MCU (R4.1), Touch Sensors (TSE6.1)
L1: MCU (R8.1), Touch Sensors (TSE7.1)
LED_DATA: Display (R22.1), MCU (MCU1.15)
MODE: MCU (R9.2), Touch Sensors (TSE8.1)
ModeSOUND: MCU (MCU1.24), Sound (DIR1.1 LL1.2)
nMCLR: MCU (C1.2 R1.1 R2.1), USB Power (R23.2)
NO: MCU (R12.2), Touch Sensors (TSE4.1)
ON_OFF: MCU (R5.1), Touch Sensors (TSE5.1)
OR: MCU (R17.2), Touch Sensors (TSE2.1)
PS1: MCU (R7.1), Touch Sensors (PSE3.1 PSE4.1)
PS2: MCU (R18.2), Touch Sensors (PSE1.1 PSE2.1)
RXD: MCU (R10.1), USB Power (Ubr1.5)
SHIELD: MCU (R19.1), Touch Sensors (PSE5.1)
TXD: MCU (R11.1), USB Power (Ubr1.4)
VIBRATE: MCU (MCU1.22), Sound (Qn1.1 R21.2)
XOR: MCU (R13.2), Touch Sensors (TSE1.1)